# Altium schematic sheet 4_COMMUNICATION.SchDoc
size 420 x 297 mm; SheetNumber: 4; SheetTotal: 6
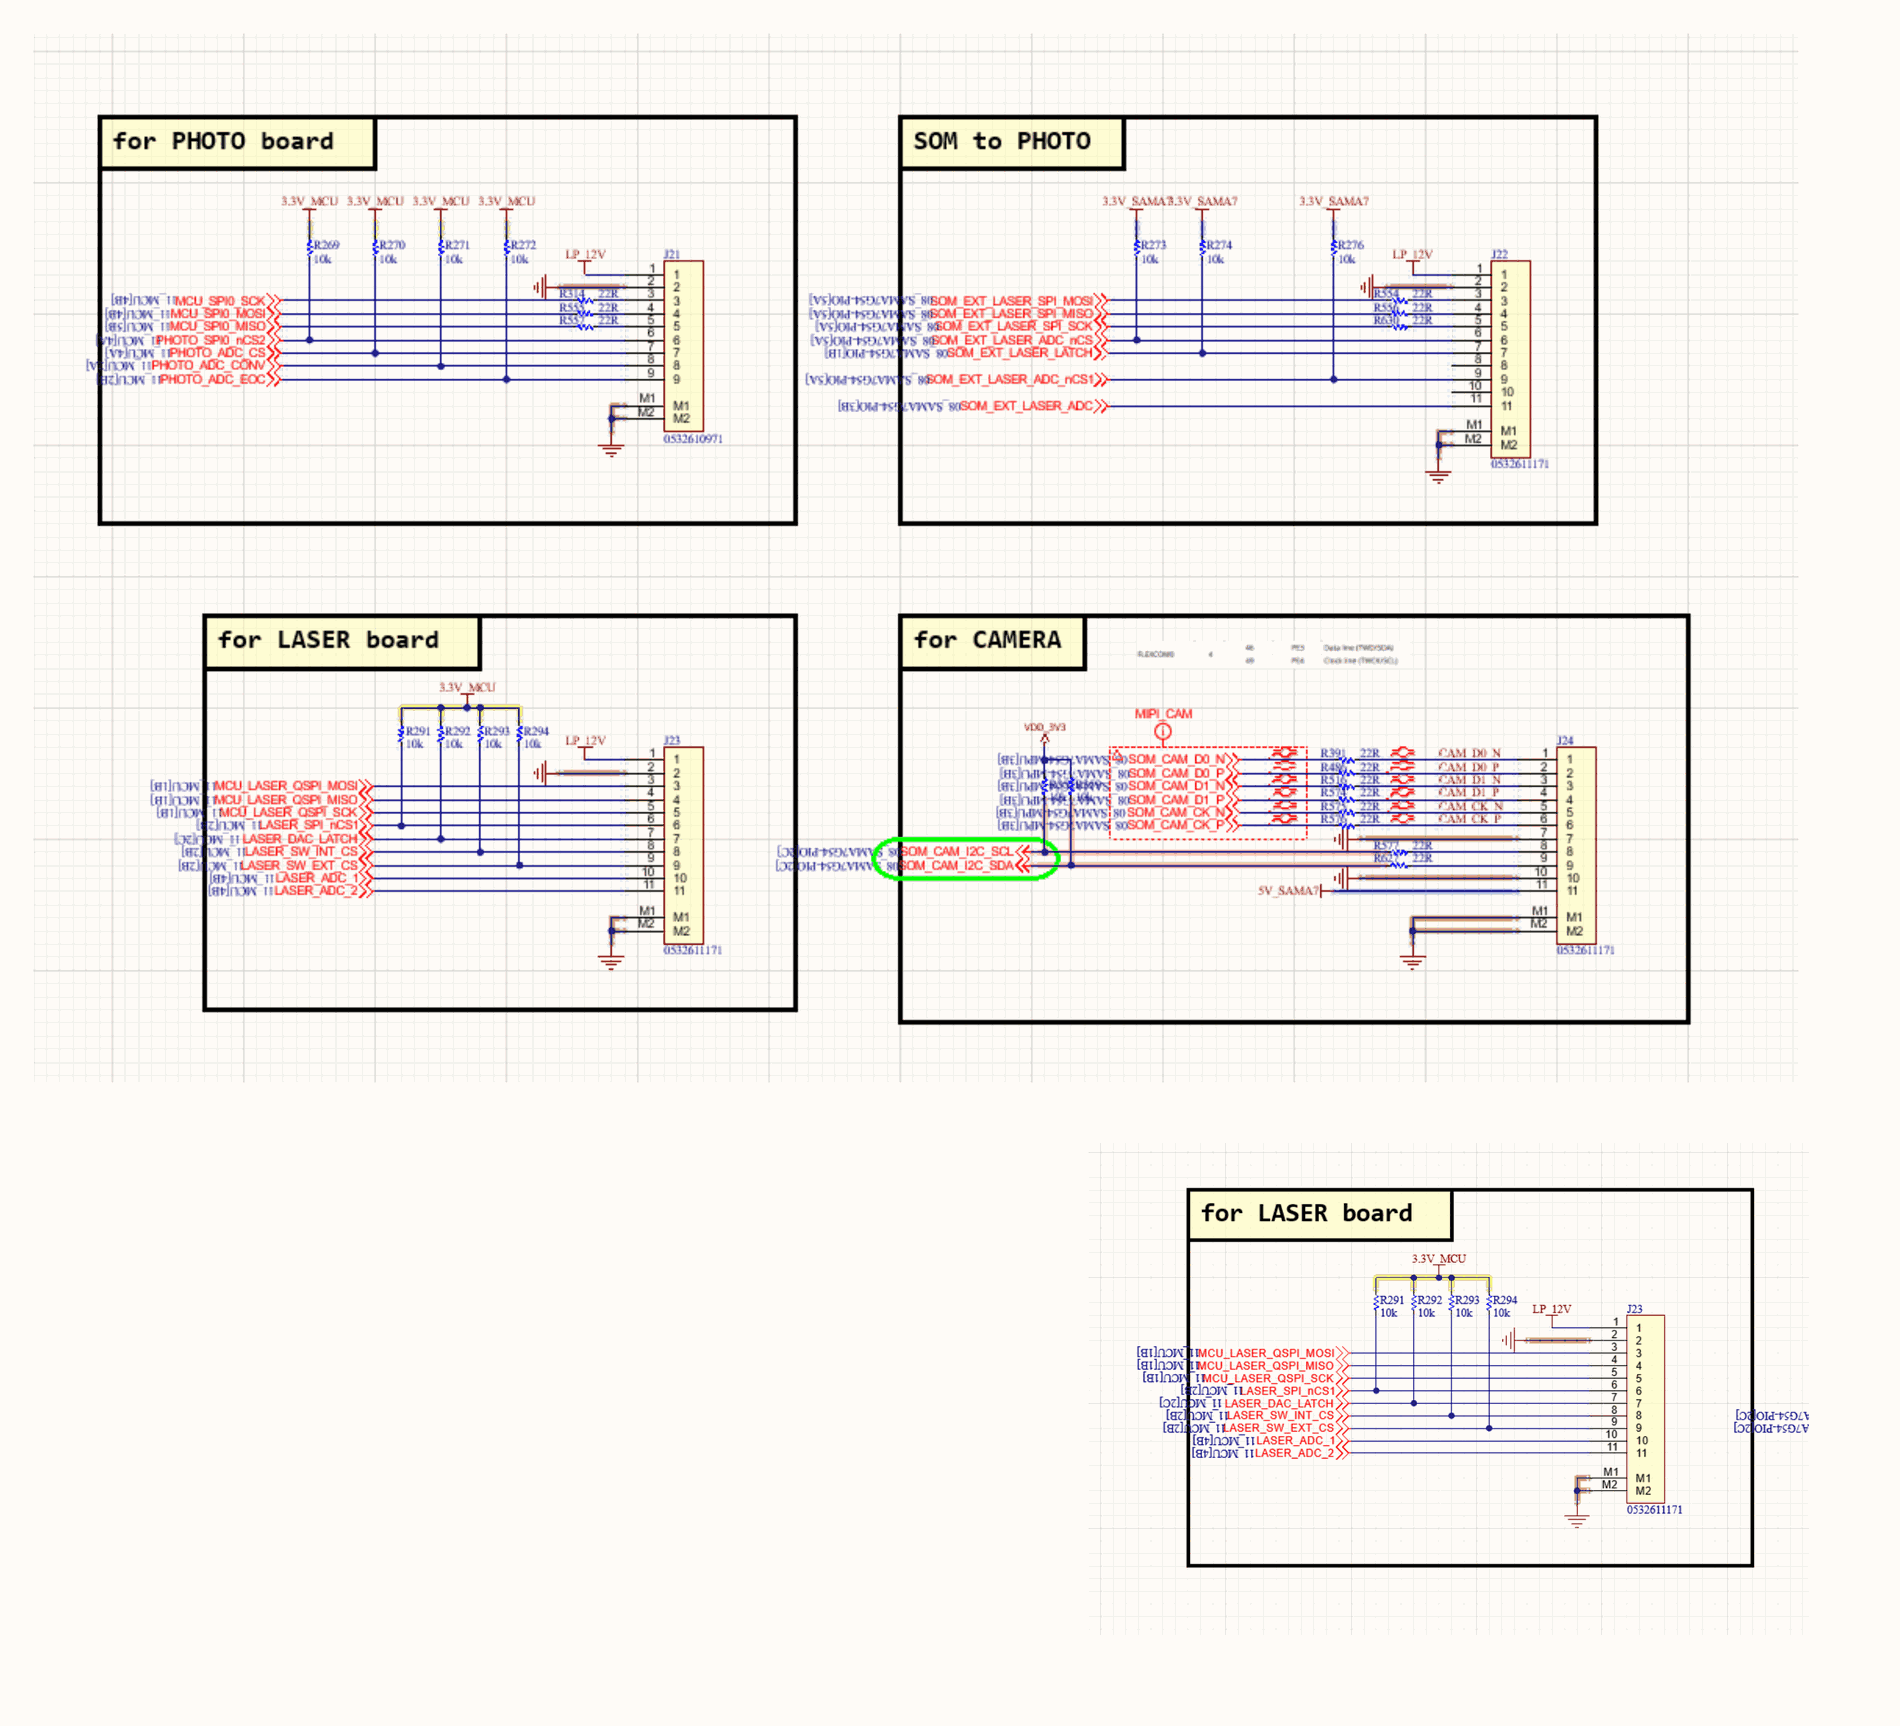
[diagram p0: 4_COMMUNICATION.SchDoc, left]
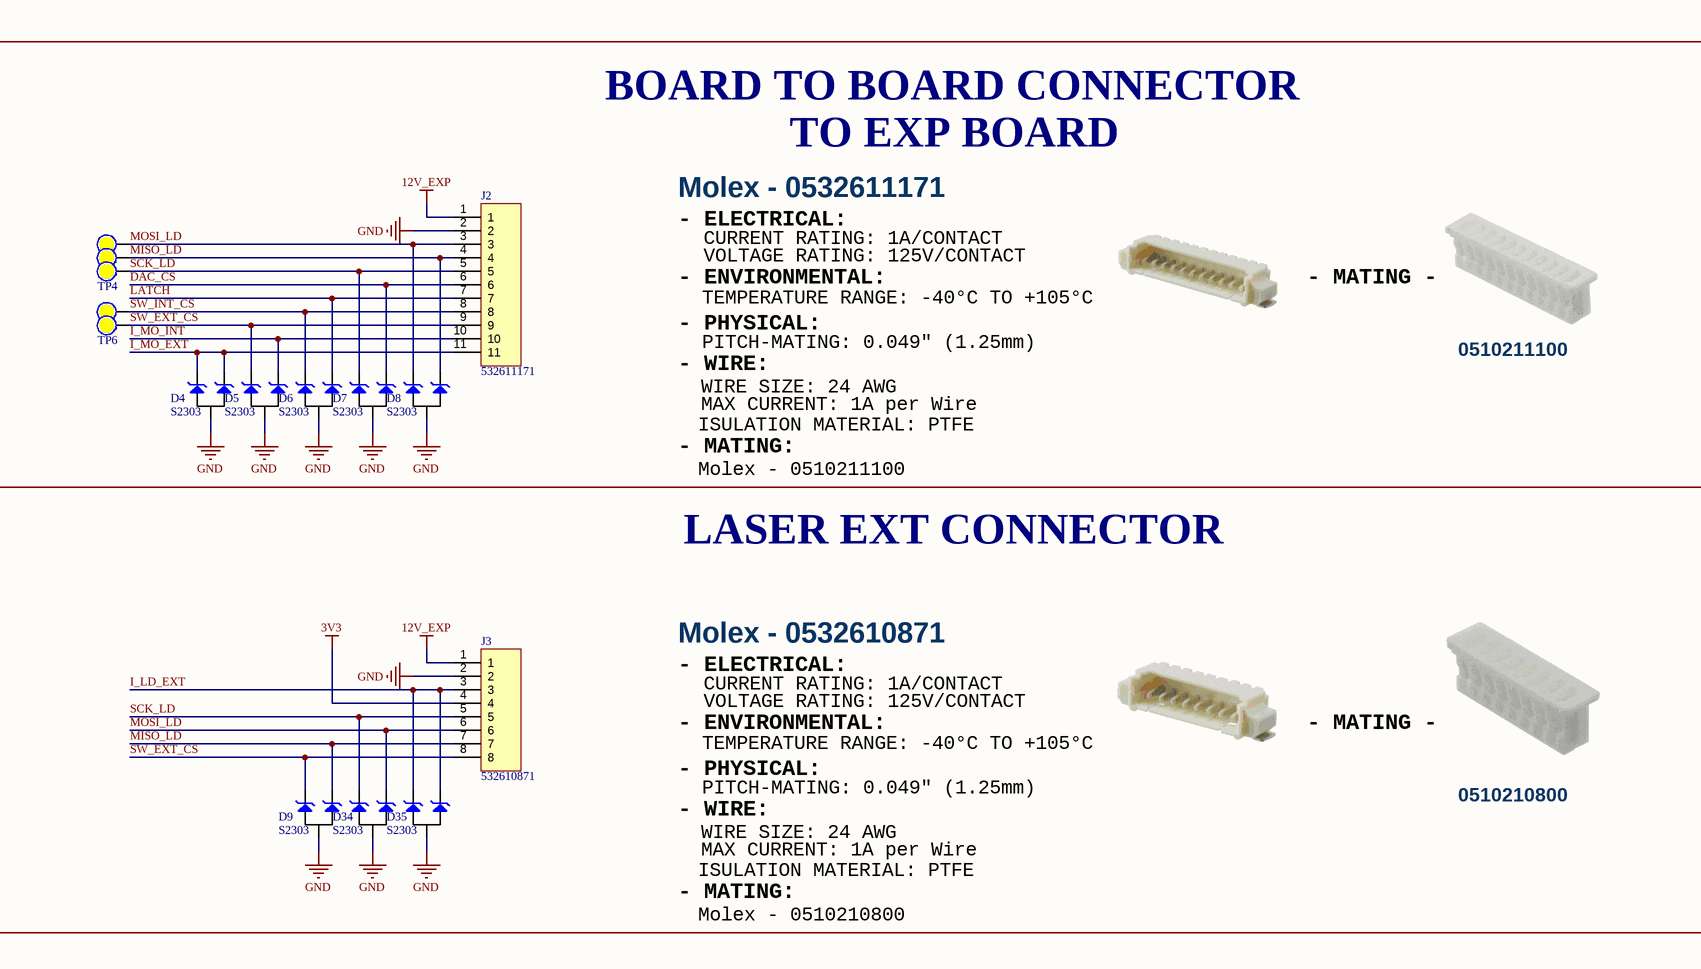
[diagram p1: 4_COMMUNICATION.SchDoc, right]

## Parts
D4  S2303  [SOT23-3-132]
D5  S2303  [SOT23-3-132]
D6  S2303  [SOT23-3-132]
D7  S2303  [SOT23-3-132]
D8  S2303  [SOT23-3-132]
D9  S2303  [SOT23-3-132]
D34  S2303  [SOT23-3-132]
D35  S2303  [SOT23-3-132]
J2  532611171  [MOLEX_0532611171]
J3  532610871  [MOLEX_0532610871]
TP2  (no value)  [Testpoint_50]  (no BOM)
TP3  (no value)  [Testpoint_50]  (no BOM)
TP4  (no value)  [Testpoint_50]  (no BOM)
TP5  (no value)  [Testpoint_50]  (no BOM)
TP6  (no value)  [Testpoint_50]  (no BOM)

## Blocks framed on the sheet
LASER EXT CONNECTOR: D9 D34 D35 J3

## Nets
3V3: J3.4
12V_EXP: J2.1 J3.1
GND: D4.3 D5.3 D6.3 D7.3 D8.3 D9.3 D34.3 D35.3 J2.2 J3.2
DAC_CS: D7.1 J2.6
I_LD_EXT: D35.1 D35.2 J3.3
I_MO_EXT: D4.1 D4.2 J2.11
I_MO_INT: D5.1 J2.10
LATCH: D6.1 J2.7
MISO_LD: D8.1 D9.1 J2.4 J3.7 TP3.1
MOSI_LD: D8.2 D34.1 J2.3 J3.6 TP2.1
SCK_LD: D7.2 D34.2 J2.5 J3.5 TP4.1
SW_EXT_CS: D5.2 D9.2 J2.9 J3.8 TP6.1
SW_INT_CS: D6.2 J2.8 TP5.1

## Notes on the sheet
- BOARD TO BOARD CONNECTOR
- Molex - 0532611171
- TO EXP BOARD
- - ELECTRICAL:
- CURRENT RATING: 1A/CONTACT
- VOLTAGE RATING: 125V/CONTACT
- - ENVIRONMENTAL:
- - PHYSICAL:
- TEMPERATURE RANGE: -40°C TO +105°C
- - MATING -
- - WIRE:
- WIRE SIZE: 24 AWG
- PITCH-MATING: 0.049" (1.25mm)
- 0510211100
- - MATING:
- ISULATION MATERIAL: PTFE
- Molex - 0510211100
- MAX CURRENT: 1A per Wire
- Molex - 0532610871
- 0510210800
- Molex - 0510210800
- Project:
- Sub-system:
- Design by:
- Sheet title:
- Sheet
- A3
- of
- Checked by:
- Approved by:
- Revision:
- Document No:
- Size:
- Date:

## Library data of the parts
J2 = 532611171: Manufacturer_Name: Molex Connector Corporation; Copyright: Copyright (C) 2025 Ultra Librarian. All rights reserved.; Manufacturer_Part_Number: 532611171; Datasheet: https://www.molex.com/en-us/products/part-detail-pdf/532611171?display=pdf; RefDes: RefDes; Type: Type
J3 = 532610871: Manufacturer_Name: Molex Connector Corporation; Copyright: Copyright (C) 2025 Ultra Librarian. All rights reserved.; Manufacturer_Part_Number: 532610871; Datasheet: https://www.molex.com/en-us/products/part-detail-pdf/532610871?display=pdf; RefDes: RefDes; Type: Type
TP2-TP6 = Test Point: Solder: NF